# EAGLE schematic cv_pot (EAGLE 6.3)
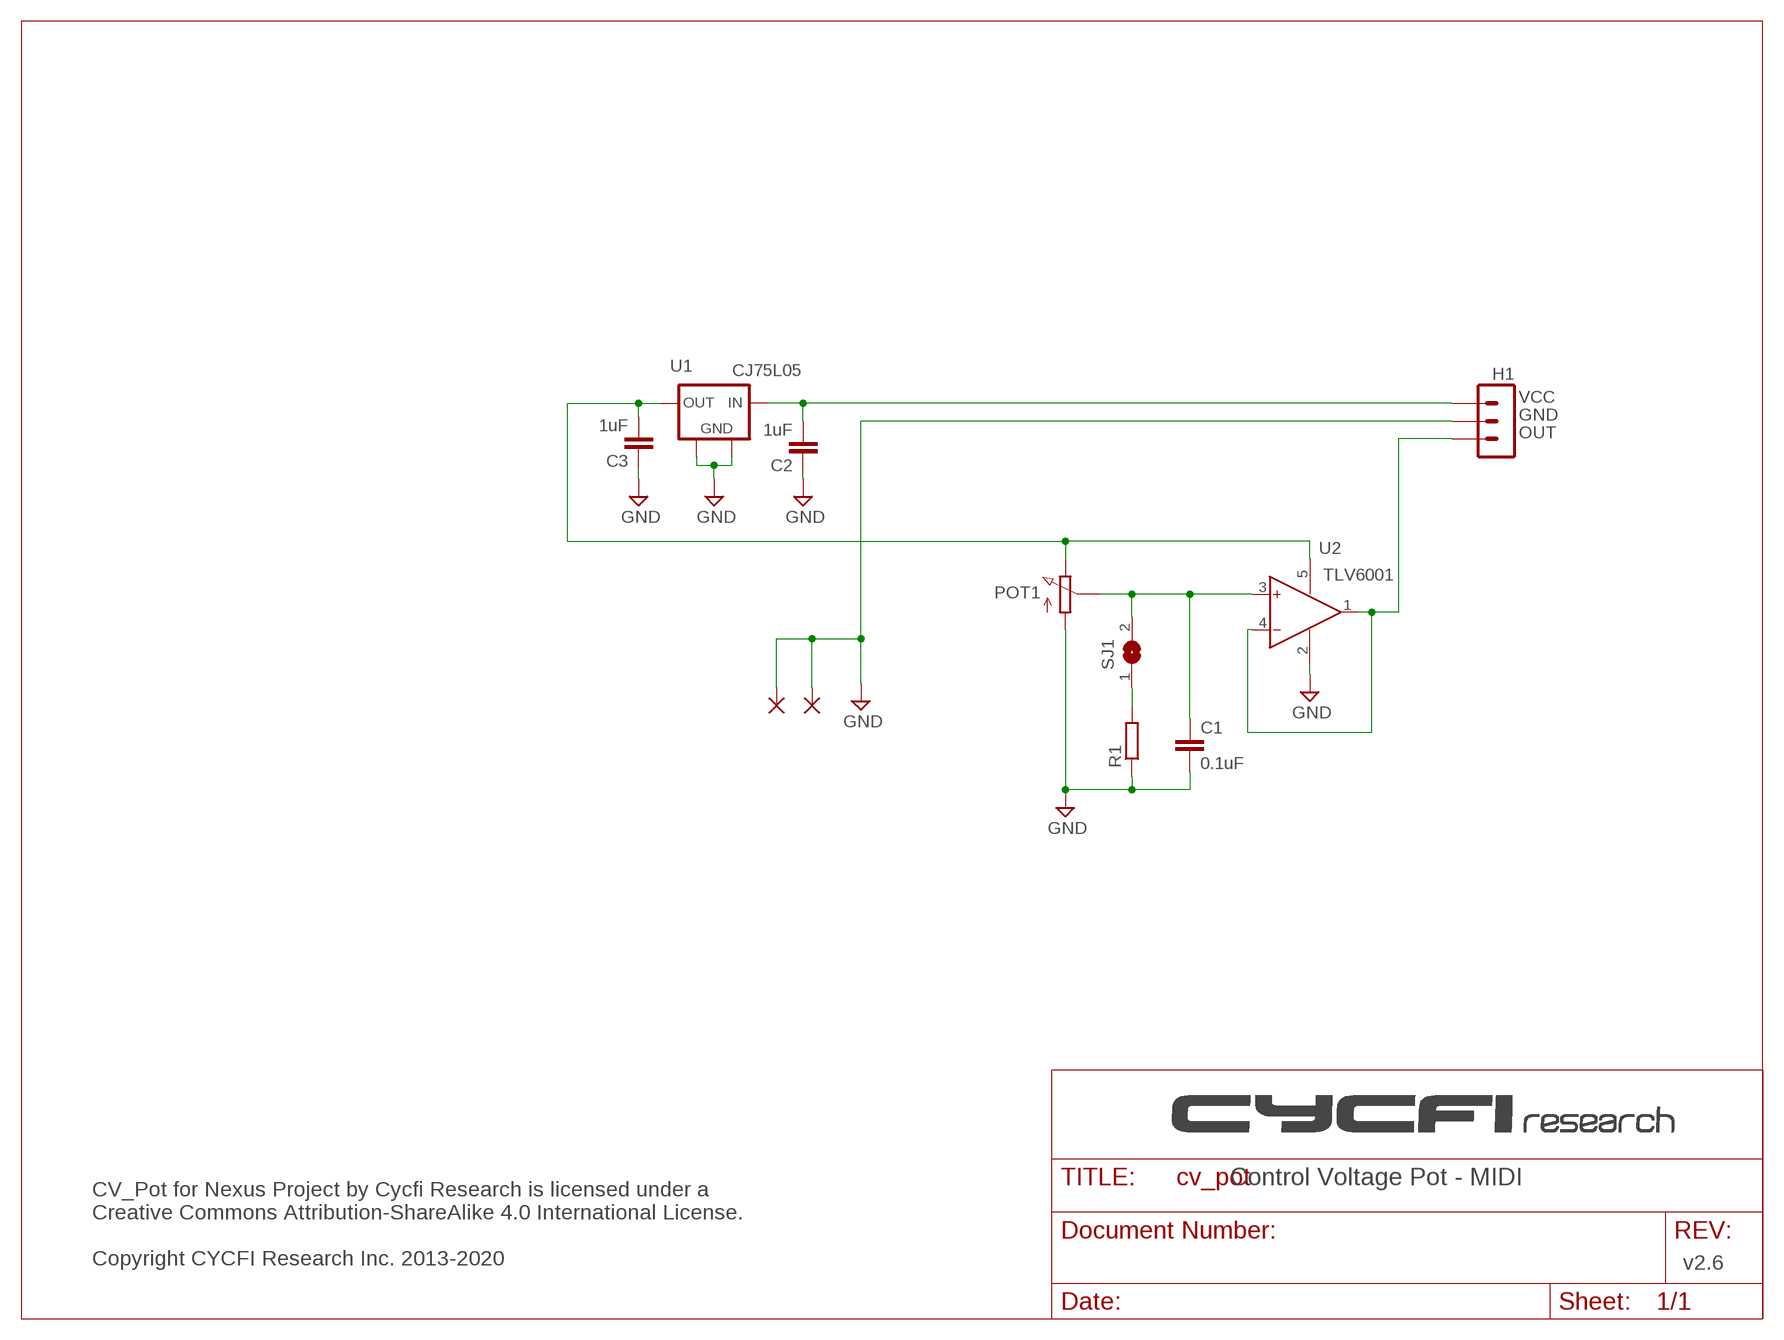
[diagram p0: schematic, sheet 1]

## Parts
C1  0.1uF  C-EUC0402  [C0402]
C2  1uF  C-EUC0603  [C0603]
C3  1uF  C-EUC0603  [C0603]
GND1  SMD2  [SMD1,27-2,54]
GND2  SMD2  [SMD1,27-2,54]
H1  3PIN-SMD-2.54MM  [3P-SMD-2.54MM]
POT1  25K  POTPDB181GTR  [POT_EU_PDB181GTR]
R1  R-EU_R0402  [R0402]
SJ1  SJ  [SJ]
U1  L78LXX  [SOT89]
U2  TLV6001  TLV170  [SOT23-5]

## Nets
GND: C1.2 C2.1 C3.1 GND1.1(P) GND2.1(P) H1.P$2 POT1.A1 R1.1 U1.2(GND) U1.2@1(GND1) U2.2(V-)
N$1: C2.2 H1.P$3 U1.3(OUT)
N$2: C3.2 POT1.A3 U1.1(IN) U2.5(V+)
N$3: C1.1 POT1.A2 SJ1.2 U2.3(IN+)
N$4: R1.2 SJ1.1
N$5: H1.P$1 U2.1(OUT) U2.4(IN-)

## Notes on the sheet
- CJ75L05
- VCC
- GND
- OUT
- U2
- Control Voltage Pot - MIDI
- CV_Pot for Nexus Project by Cycfi Research is licensed under a 
  Creative Commons Attribution-ShareAlike 4.0 International License. 
  
  Copyright CYCFI Research Inc. 2013-2020
- v2.6

## Library data of the parts
C1-C3 = resistor:C-EU: CAPACITOR, European symbol
GND1 GND2 = wirepad:SMD2: SMD PAD
H1 = CYCFI_Con:3PIN-SMD-2.54MM
POT1 = CYCFI_Passive:POT
R1 = rcl:R-EU_: RESISTOR, European symbol
SJ1 = jumper:SJ: SMD solder JUMPER
U1 = CYCFI_Power:L78LXX
U2 = CYCFI_semicon:TLV170